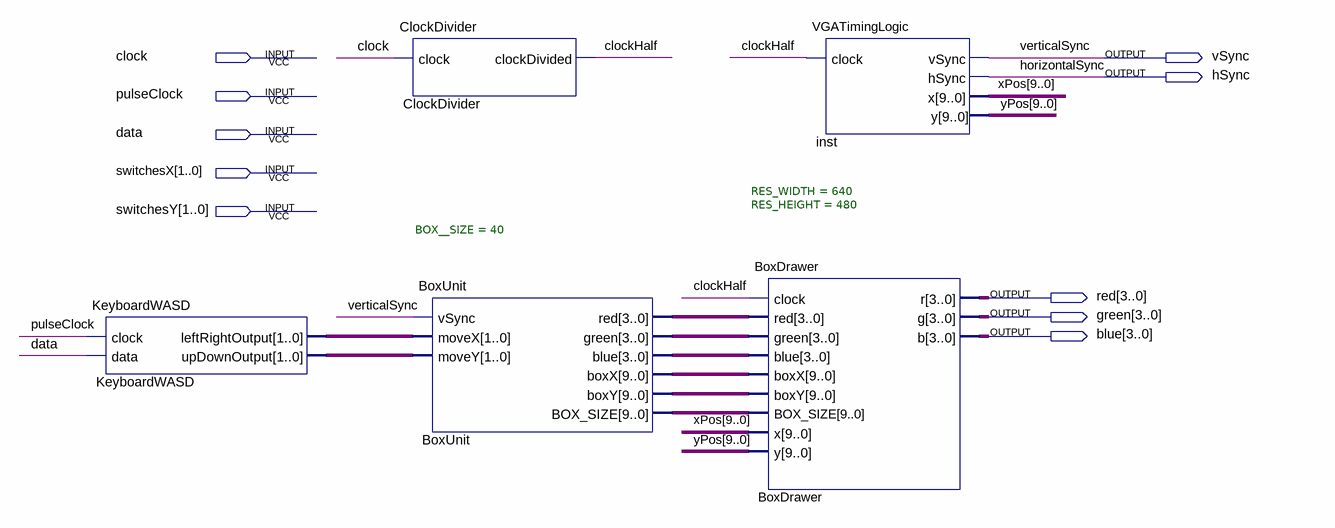
[diagram p0: schematic sheet]
// Quartus schematic PS2Keyboard.bdf as structural Verilog: 5 symbols, 10 pins
module PS2Keyboard (
  input  clock,
  input  pulseClock,
  input  data,
  input  [1:0] switchesX,
  input  [1:0] switchesY,
  output vSync,
  output hSync,
  output [3:0] red,
  output [3:0] green,
  output [3:0] blue
);

  wire clockHalf;
  wire [1:0] moveX, moveY;
  wire [3:0] blueBoxUnit, greenBoxUnit, redBoxUnit;
  wire [9:0] BOX_SIZE, boxX, boxY, xPos, yPos;

  KeyboardWASD KeyboardWASD (.clock(pulseClock), .data(data), .leftRightOutput(moveX), .upDownOutput(moveY));
  ClockDivider ClockDivider (.clock(clock), .clockDivided(clockHalf));
  BoxUnit #(.BOX__SIZE(40)) BoxUnit (
    .vSync(vSync), .moveX(moveX), .moveY(moveY), .red(redBoxUnit), .green(greenBoxUnit), .blue(blueBoxUnit),
    .boxX(boxX), .boxY(boxY), .BOX_SIZE(BOX_SIZE));
  BoxDrawer #(.RES_WIDTH(640), .RES_HEIGHT(480)) BoxDrawer (
    .clock(clockHalf), .red(redBoxUnit), .green(greenBoxUnit), .blue(blueBoxUnit), .boxX(boxX), .boxY(boxY),
    .BOX_SIZE(BOX_SIZE), .x(xPos), .y(yPos), .r(red), .g(green), .b(blue));
  VGATimingLogic inst (.clock(clockHalf), .vSync(vSync), .hSync(hSync), .x(xPos), .y(yPos));

  // Other names for the same wires on the sheet: horizontalSync = hSync; verticalSync = vSync
endmodule
